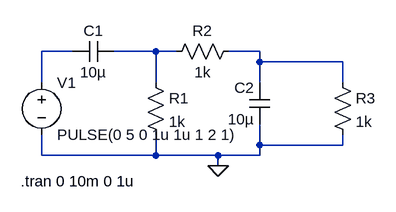
[diagram p0: schematic Circuito3.asc]
Circuito3.asc, the LTspice schematic file:
Version 4.1
SHEET 1 880 680
WIRE 48 16 0 16
WIRE 176 16 112 16
WIRE 208 16 176 16
WIRE 336 16 288 16
WIRE 336 32 336 16
WIRE 464 32 336 32
WIRE 0 64 0 16
WIRE 176 64 176 16
WIRE 336 64 336 32
WIRE 464 64 464 32
WIRE 336 160 336 128
WIRE 464 160 464 144
WIRE 464 160 336 160
WIRE 0 176 0 144
WIRE 176 176 176 144
WIRE 176 176 0 176
WIRE 272 176 176 176
WIRE 336 176 336 160
WIRE 336 176 272 176
WIRE 272 192 272 176
FLAG 272 192 0
SYMBOL voltage 0 48 R0
WINDOW 123 0 0 Left 0
WINDOW 39 0 0 Left 0
SYMATTR InstName V1
SYMATTR Value PULSE(0 5 0 1u 1u 1 2 1)
SYMBOL res 160 48 R0
SYMATTR InstName R1
SYMATTR Value 1k
SYMBOL res 304 0 R90
WINDOW 0 0 56 VBottom 2
WINDOW 3 32 56 VTop 2
SYMATTR InstName R2
SYMATTR Value 1k
SYMBOL res 448 48 R0
SYMATTR InstName R3
SYMATTR Value 1k
SYMBOL cap 112 0 R90
WINDOW 0 0 32 VBottom 2
WINDOW 3 32 32 VTop 2
SYMATTR InstName C1
SYMATTR Value 10µ
SYMBOL cap 352 128 R180
WINDOW 0 24 56 Left 2
WINDOW 3 24 8 Left 2
SYMATTR InstName C2
SYMATTR Value 10µ
TEXT -32 216 Left 2 !.tran 0 10m 0 1u

The netlist it stands for:
* Circuito3.asc
V1 N001 0 PULSE(0 5 0 1u 1u 1 2 1)
R1 N002 0 1k
R2 N003 N002 1k
R3 N003 0 1k
C1 N002 N001 10µ
C2 0 N003 10µ
.tran 0 10m 0 1u
.backanno
.end